# Altium project GSM.PrjPCB
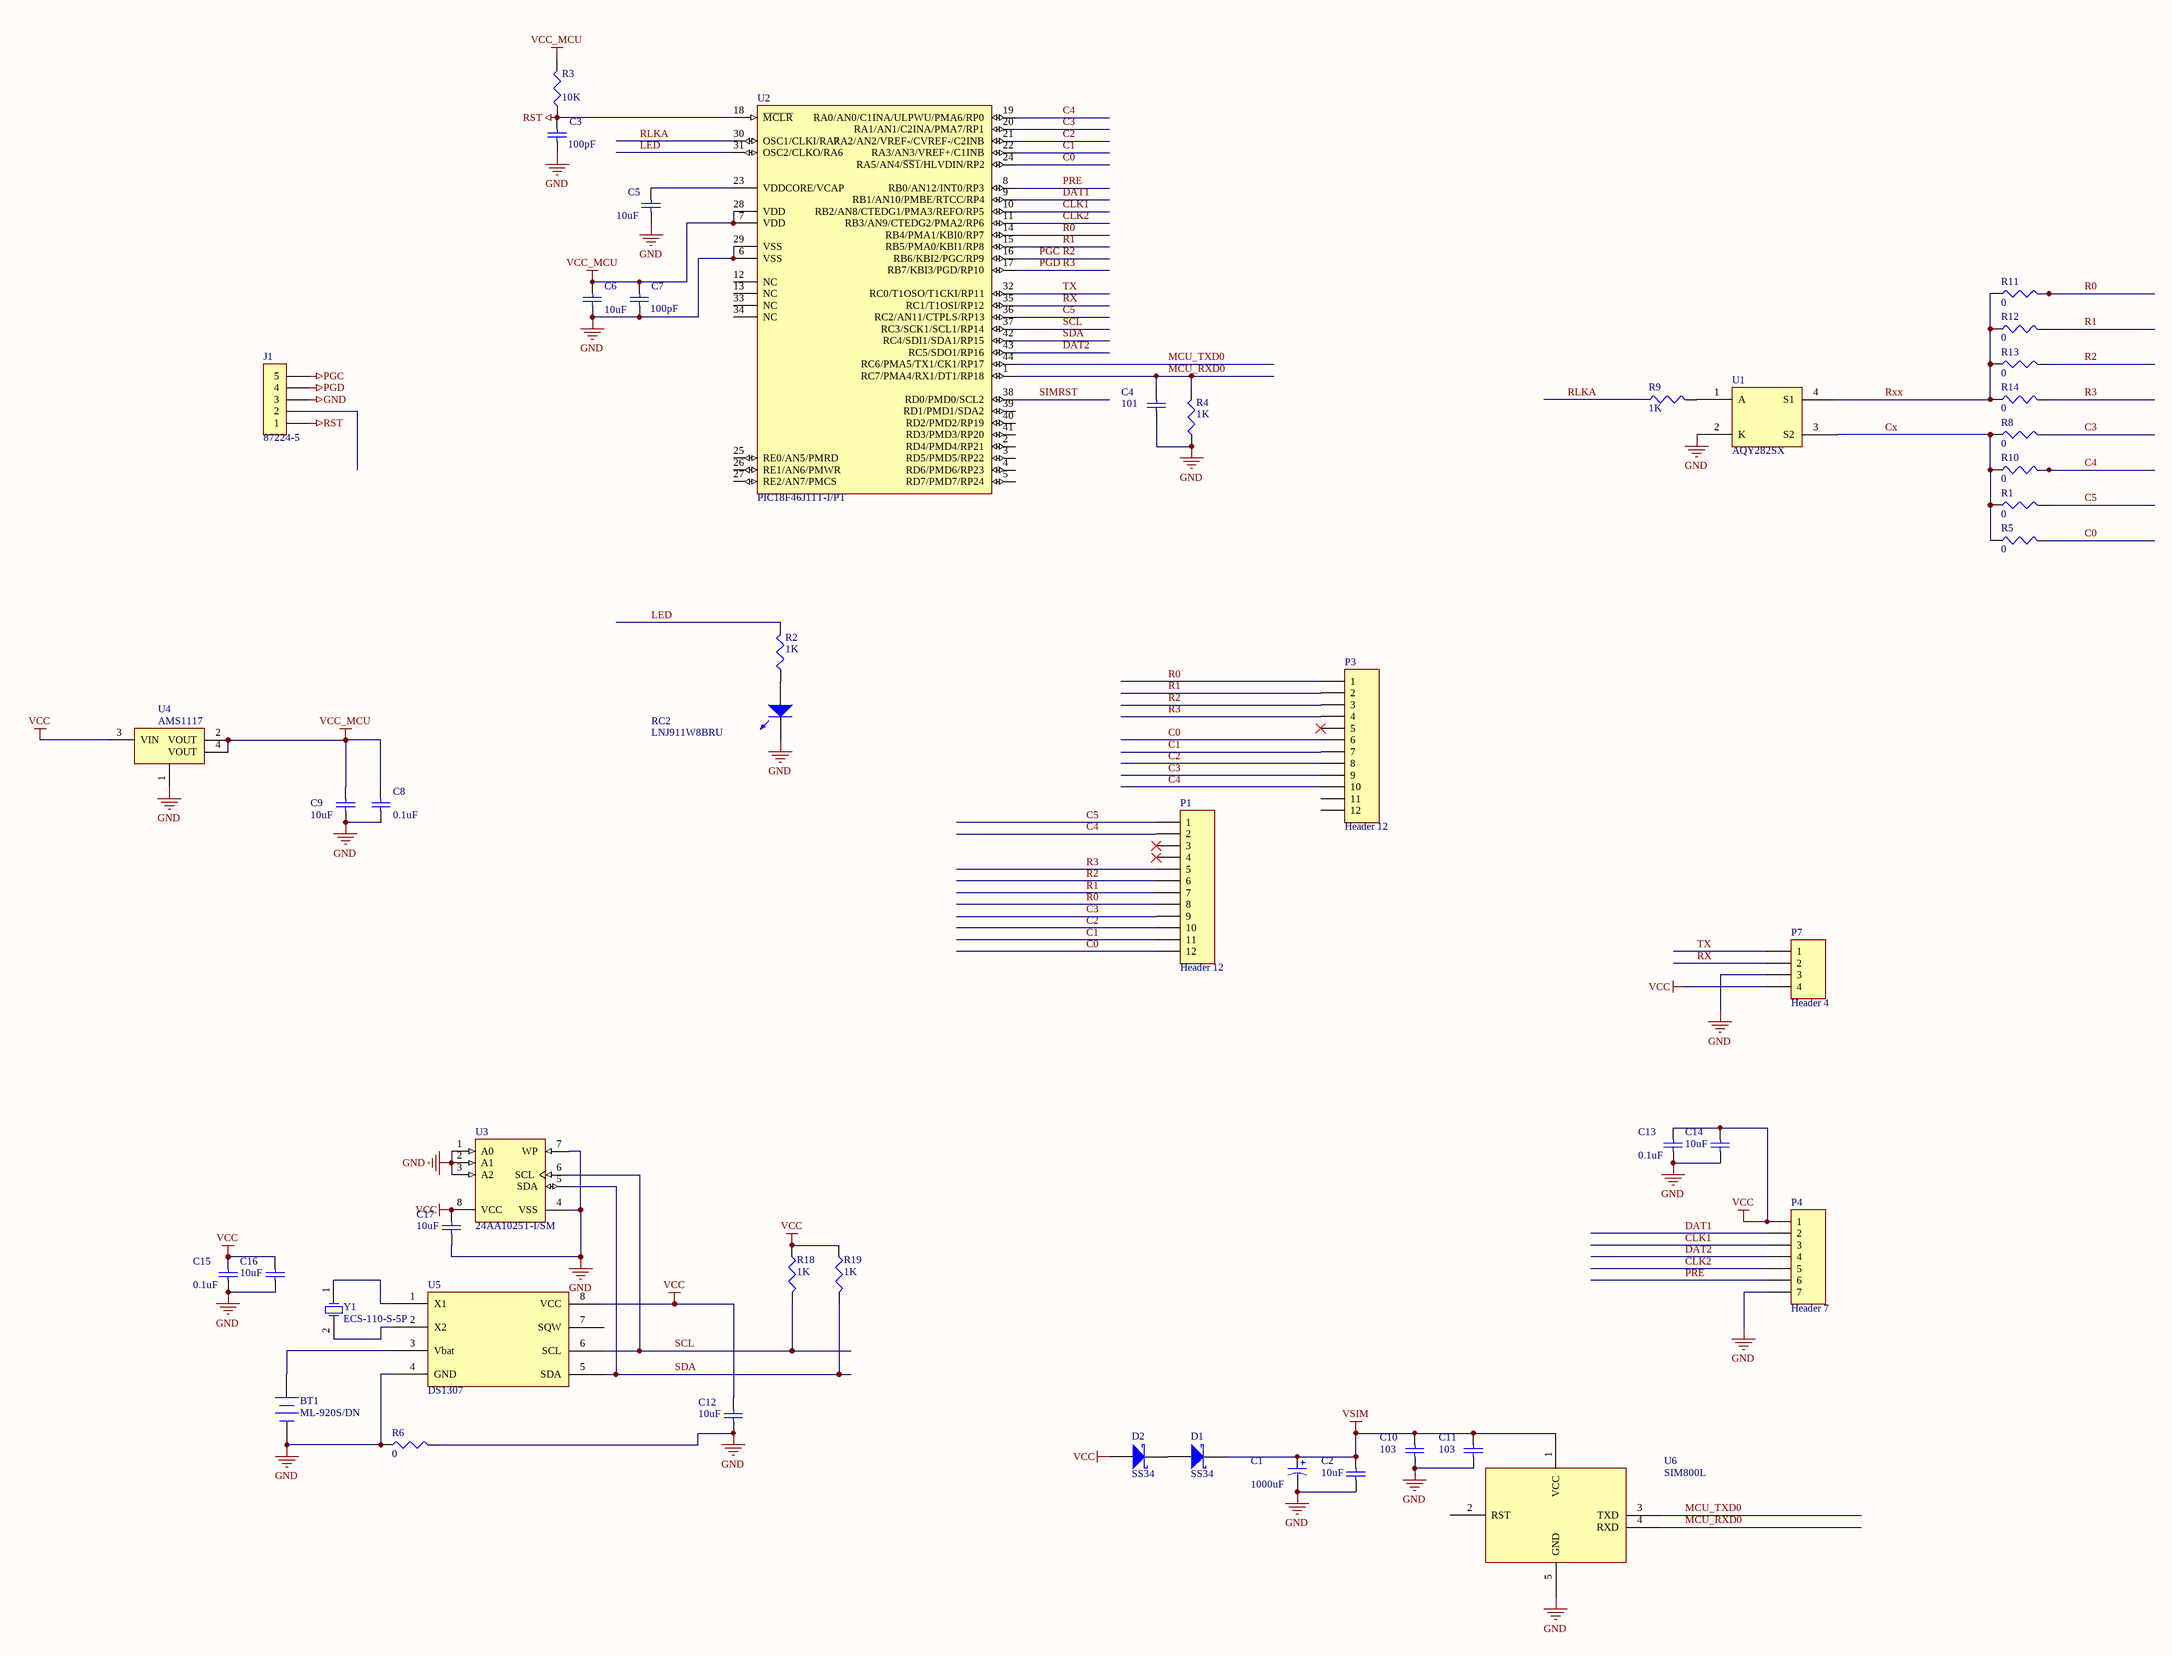
[diagram p0: Sheet1.SchDoc]
1 sheet, 48 parts. Net scope: global (net labels, ports and power ports of the same name join across sheets).
Board file: PCB1.PcbDoc

## Sheet Sheet1.SchDoc
size C

### Parts
BT1  ML-920S/DN  [ML-920S/DN]
C1  value 1000uF  [CAP8x8]  (hidden comment: EEE-FT1A102AP)
C2  value 10uF  [RESC2012L]  (hidden comment: LMK212F106ZG-T)
C3  value 100pF  [CAPC2013X05N]  (hidden comment: Cap Semi)
C4  value 101  [RESC2012L]  (hidden comment: LMK212F106ZG-T)
C5  value 10uF  [CAPC2013X05N]  (hidden comment: Cap Semi)
C6  value 10uF  [CAPC2013X05N]  (hidden comment: Cap Semi)
C7  value 100pF  [CAPC2013X05N]  (hidden comment: Cap Semi)
C8  value 0.1uF  [RESC2012L]  (hidden comment: CL21F104ZBCNNNC)
C9  value 10uF  [RESC2012L]  (hidden comment: LMK212F106ZG-T)
C10  value 103  [RESC2012L]  (hidden comment: LMK212F106ZG-T)
C11  value 103  [RESC2012L]  (hidden comment: LMK212F106ZG-T)
C12  value 10uF  [RESC2012L]  (hidden comment: LMK212F106ZG-T)
C13  value 0.1uF  [RESC2012L]  (hidden comment: CL21F104ZBCNNNC)
C14  value 10uF  [RESC2012L]  (hidden comment: LMK212F106ZG-T)
C15  value 0.1uF  [RESC2012L]  (hidden comment: CL21F104ZBCNNNC)
C16  value 10uF  [RESC2012L]  (hidden comment: LMK212F106ZG-T)
C17  value 10uF  [RESC2012L]  (hidden comment: LMK212F106ZG-T)
D1  SS34  [SMB]
D2  SS34  [SMB]
J1  87224-5  [CON5]
P1  Header 12  [HDR1X12]
P3  Header 12  [HDR1X12]
P4  Header 7  [HDR1X7]
P7  Header 4  [HDR1X4]
R1  value 0  [JUM1]  (hidden comment: ERJ-6GEYJ331V)
R2  value 1K  [RESC2012L]  (hidden comment: ERJ-6GEYJ102V)
R3  value 10K  [RESC2013X05N]  (hidden comment: Res3)
R4  value 1K  [RESC2012L]  (hidden comment: ERJ-6GEYJ102V)
R5  value 0  [JUM1]  (hidden comment: ERJ-6GEYJ331V)
R6  value 0  [JUM1]  (hidden comment: ERJ-6GEYJ331V)
R8  value 0  [JUM1]  (hidden comment: ERJ-6GEYJ331V)
R9  value 1K  [RESC2012L]  (hidden comment: ERJ-6GEYJ331V)
R10  value 0  [JUM1]  (hidden comment: ERJ-6GEYJ331V)
R11  value 0  [JUM1]  (hidden comment: ERJ-6GEYJ331V)
R12  value 0  [JUM1]  (hidden comment: ERJ-6GEYJ331V)
R13  value 0  [JUM1]  (hidden comment: ERJ-6GEYJ331V)
R14  value 0  [JUM1]  (hidden comment: ERJ-6GEYJ331V)
R18  value 1K  [RESC2012L]  (hidden comment: ERJ-6GEYJ331V)
R19  value 1K  [RESC2012L]  (hidden comment: ERJ-6GEYJ331V)
RC2  LNJ911W8BRU  [CD3216-1206]
U1  AQY282SX  [SOP4]
U2  PIC18F46J11T-I/PT  [TQFP-PT44_N]
U3  24AA1025T-I/SM  [SOIJ-SM8_N]
U4  AMS1117  [SOT223-4M]
U5  DS1307  [SOIJ-SM8_N]
U6  SIM800L  [SIM800L]
Y1  ECS-110-S-5P  [ABS07]

### Nets
GND: BT1.2(-) C1.2 C2.2 C3.1 C4.2 C5.1 C6.1 C7.1 C8.2 C9.2 C10.2 C11.2 C12.2 C13.2 C14.2 C15.2 C16.2 C17.2 J1.3 P4.7 P7.3 R4.2 R6.1 R6.2 RC2.2(K) U1.2(K) U2.6(VSS) U2.29(VSS) U3.1(A0) U3.2(A1) U3.3(A2) U3.4(VSS) U3.7(WP) U4.1(GND) U5.4(GND) U6.5(GND)
PGC: J1.5 P1.6 P3.3 R13.1 U2.16(RB6/KBI2/PGC/RP9)  [also labelled R2]
PGD: J1.4 P1.5 P3.4 R14.1 U2.17(RB7/KBI3/PGD/RP10)  [also labelled R3]
RST: C3.2 J1.1 R3.1 U2.18(~{MCLR})
VCC: C12.1 C13.1 C14.1 C15.1 C16.1 C17.1 D2.1(A) P4.1 P7.4 R18.2 R19.2 U3.8(VCC) U4.3(VIN) U5.8(VCC)
VCC_MCU: C6.2 C7.2 C8.1 C9.1 R3.2 U2.7(VDD) U2.28(VDD) U4.2(VOUT) U4.4(VOUT)
VSIM: C1.1 C2.1 C10.1 C11.1 D1.2(K) U6.1(VCC)
C0: P1.12 P3.6 R5.1 U2.24(RA5/AN4/~{SS1}/HLVDIN/RP2)
C1: P1.11 P3.7 U2.22(RA3/AN3/VREF+/C1INB)
C2: P1.10 P3.8 U2.21(RA2/AN2/VREF-/CVREF-/C2INB)
C3: P1.9 P3.9 R8.1 U2.20(RA1/AN1/C2INA/PMA7/RP1)
C4: P1.2 P3.10 R10.1 U2.19(RA0/AN0/C1INA/ULPWU/PMA6/RP0)
C5: P1.1 R1.1 U2.36(RC2/AN11/CTPLS/RP13)
CLK1: P4.3 U2.10(RB2/AN8/CTEDG1/PMA3/REFO/RP5)
CLK2: P4.5 U2.11(RB3/AN9/CTEDG2/PMA2/RP6)
Cx: R1.2 R5.2 R8.2 R10.2 U1.3(S2)
DAT1: P4.2 U2.9(RB1/AN10/PMBE/RTCC/RP4)
DAT2: P4.4 U2.43(RC5/SDO1/RP16)
LED: R2.1 U2.31(OSC2/CLKO/RA6)
MCU_RXD0: C4.1 R4.1 U2.1(RC7/PMA4/RX1/DT1/RP18) U6.4(RXD)
MCU_TXD0: U2.44(RC6/PMA5/TX1/CK1/RP17) U6.3(TXD)
PRE: P4.6 U2.8(RB0/AN12/INT0/RP3)
R0: P1.8 P3.1 R11.1 U2.14(RB4/PMA1/KBI0/RP7)
R1: P1.7 P3.2 R12.1 U2.15(RB5/PMA0/KBI1/RP8)
RLKA: R9.2 U2.30(OSC1/CLKI/RA7)
RX: P7.2 U2.35(RC1/T1OSI/RP12)
Rxx: R11.2 R12.2 R13.2 R14.2 U1.4(S1)
SCL: R18.1 U2.37(RC3/SCK1/SCL1/RP14) U3.6(SCL) U5.6(SCL)
SDA: R19.1 U2.42(RC4/SDI1/SDA1/RP15) U3.5(SDA) U5.5(SDA)
SIMRST: U2.38(RD0/PMD0/SCL2)
TX: P7.1 U2.32(RC0/T1OSO/T1CKI/RP11)
NetBT1_1: BT1.1(+) U5.3(Vbat)
NetC5_2: C5.2 U2.23(VDDCORE/VCAP)
NetD1_1: D1.1(A) D2.2(K)
NetR2_2: R2.2 RC2.1(A)
NetR9_1: R9.1 U1.1(A)
NetU5_1: U5.1(X1) Y1.1(OSC1)
NetU5_2: U5.2(X2) Y1.2(OSC2)

Not connected (* = marked no-connect by the designer): J1 2; P1 3* 4*; P3 5* 11 12; U2 2(RD4/PMD4/RP21) 3(RD5/PMD5/RP22) 4(RD6/PMD6/RP23) 5(RD7/PMD7/RP24) 12(NC) 13(NC) 25(RE0/AN5/PMRD) 26(RE1/AN6/PMWR) 27(RE2/AN7/PMCS) 33(NC) 34(NC) 39(RD1/PMD1/SDA2) 40(RD2/PMD2/RP19) 41(RD3/PMD3/RP20); U5 7(SQW); U6 2(RST)

### Library data of the parts
BT1 = Battery: Multicell Battery; Published: 24-Mar-1999; LatestRevisionDate: 17-Jul-2002; LatestRevisionNote: Re-released for DXP Platform.; PackageReference: BAT-2; Publisher: Altium Limited; PackageDescription: Battery; 2 Leads
C1 = Cap Pol1: CAP ALUM 1000UF 10V 20% SMD; Published: 8-Jun-2000; LatestRevisionDate: 17-Jul-2002; LatestRevisionNote: Re-released for DXP Platform.; PackageReference: RB7.6-15; Publisher: Altium Limited; PackageDescription: Polarized Capacitor (Radial); 2 Leads
C2 C4 C9-C12 C14 C16 C17 = Cap: CAP CER 10UF 10V Y5V 0805; Published: 8-Jun-2000; LatestRevisionDate: 17-Jul-2002; LatestRevisionNote: Re-released for DXP Platform.; PackageReference: RAD-0.3; Publisher: Altium Limited; PackageDescription: Radial Cap, Thru-Hole; 2 Leads; 0.3 in Pin Spacing
C3 C5-C7 = Cap Semi: Capacitor (Semiconductor SIM Model); Published: 8-Jun-2000; LatestRevisionDate: 29-May-2009; LatestRevisionNote: IPC-7351 Footprint Added.; PackageReference: C1206; Publisher: Altium Limited; PackageDescription: Chip Capacitor
C8 C13 C15 = Cap: CAP CER 0.1UF 50V Y5V 0805; Published: 8-Jun-2000; LatestRevisionDate: 17-Jul-2002; LatestRevisionNote: Re-released for DXP Platform.; PackageReference: RAD-0.3; Publisher: Altium Limited; PackageDescription: Radial Cap, Thru-Hole; 2 Leads; 0.3 in Pin Spacing
D1 D2 = D Schottky SS34: DIODE SCHOTTKY 40V 3A SMC; Published: 8-Jun-2000; LatestRevisionDate: 17-Jul-2002; LatestRevisionNote: Re-released for DXP Platform.; PackageReference: SMB; Publisher: Altium Limited; PackageDescription: DO-214-AA/SMB; 2 C-Bend Leads; Body 5.3 x 3.6 mm, inc. leads (LxW); Code_JEDEC: DO-214-AA
J1 = CON5: CONN HEADER VERT .100 5POS 15AU
P1 P3 = Header 12: Header, 12-Pin; LatestRevisionDate: 17-Jul-2002; LatestRevisionNote: Re-released for DXP Platform.; Publisher: Altium Limited
P4 = Header 7: Header, 7-Pin; LatestRevisionDate: 17-Jul-2002; LatestRevisionNote: Re-released for DXP Platform.; Publisher: Altium Limited
P7 = Header 4: Header, 4-Pin; LatestRevisionDate: 17-Jul-2002; LatestRevisionNote: Re-released for DXP Platform.; Publisher: Altium Limited
R1 R5 R6 R8-R14 R18 R19 = Res3: RES 330 OHM 1/8W 5% 0805 SMD; Published: 8-Jun-2000; LatestRevisionDate: 29-May-2009; LatestRevisionNote: IPC-7351 Footprint Added.; PackageReference: J1-0603; Publisher: Altium Limited; PackageDescription: Chip Resistor
R2 R4 = Res3: RES 1K OHM 1/8W 5% 0805 SMD; Published: 8-Jun-2000; LatestRevisionDate: 29-May-2009; LatestRevisionNote: IPC-7351 Footprint Added.; PackageReference: J1-0603; Publisher: Altium Limited; PackageDescription: Chip Resistor
R3 = Res3: Resistor; Published: 8-Jun-2000; LatestRevisionDate: 29-May-2009; LatestRevisionNote: IPC-7351 Footprint Added.; PackageReference: J1-0603; Publisher: Altium Limited; PackageDescription: Chip Resistor
RC2 = LEDRED1206: LED BLUE THRU BOARD 1206; VENDOR P/N: LH N974-KN-1; VENDOR: OSRAM Opto Semiconductors Inc; Indicate: 12V; GGC VENDOR: OSRAM Opto Semiconductors Inc; GCC P/N: LH N974-KN-1; DIGIKEY P/N: P0.0JCT-ND; DIGIKEY MOQ1: 0.11
U1 = AQY282SX: RELAY OPTO 60VAC/DC 500MA 4-SOP; Digi-Key Part Number: 255-3393-2-ND
U2 = PIC18F46J11T-I/PT: Low Power, High Performance Microcontroller with nanoWatt XLP Technology, 44-pin TQFP, Industrial Temperature, Tape and Reel; Published: 2-Dec-2009; DatasheetVersion: revC, Oct-2009; PackageVersion: revBB, Aug-2009; PackageReference: TQFP-PT44; Publisher: Altium Limited; PackageDescription: 44-Lead Plastic Thin Quad Flatpack (PT) - 10x10x1mm Body, 2.00mm [TQFP]; Supplier 1: Digi-Key; Supplier Part Number 1: PIC18F46J11T-I/PT-ND; Code_JEDEC: MS-026; ComponentLink1Description: Datasheet; ComponentLink1URL: http://ww1.microchip.com/downloads/en/DeviceDoc/39932c.pdf; ComponentLink2Description: Packaging Specification; ComponentLink2URL: http://www.microchip.com/stellent/groups/techpub_sg/documents/packagingspec/en012702.pdf; ComponentLink3Description: Microchip.com Home; ComponentLink3URL: http://www.microchip.com/
U3 = 24AA1025T-I/SM: 1 Mbit, 400kHz, 1.7V, I2C Serial EEPROM, 8-Pin SOIC 208mil, Industrial Temperature, Tape and Reel; Published: 29-Jan-2009; DatasheetVersion: revF, Oct-2008; PackageVersion: revBB, Aug-2009; PackageReference: SOIJ-SM8; Publisher: Altium Limited; PackageDescription: 8-Lead Plastic Small Outline (SM) - Medium, 5.28 mm Body [SOIJ]; Supplier 1: Digi-Key; Supplier Part Number 1: 24AA1025T-I/SM-ND; ComponentLink1Description: Datasheet; ComponentLink1URL: http://ww1.microchip.com/downloads/en/DeviceDoc/21941F.pdf; ComponentLink2Description: Packaging Specification; ComponentLink2URL: http://www.microchip.com/stellent/groups/techpub_sg/documents/packagingspec/en012702.pdf; ComponentLink3Description: Microchip.com Home; ComponentLink3URL: http://www.microchip.com/
U4 = AMS1117: Adjustable Precision Shunt Regulator; Published: 15-Apr-2002; DatasheetVersion: Oct-2000; PackageVersion: Oct-1994; PackageReference: PK03; Publisher: Altium Limited; PackageDescription: SOT-89; Body 4.6 x 4.25 mm, inc. leads (LxW max); Code_JEDEC: TO-243-AA; Code_IPC: SOT 89; ComponentLink1Description: Manufacturer Link; ComponentLink1URL: http://www.ti.com/; ComponentLink2Description: Datasheet; ComponentLink2URL: http://www-s.ti.com/sc/ds/tl431a.pdf
Y1 = ECS-110-S-5P: Crystal Oscillator; Published: 17-Jul-2002; DatasheetDocument: 18-Apr-2000; PackageReference: CSM-7; Publisher: Altium Limited; ComponentLink1Description: Manufacturer Link; ComponentLink1URL: http://www.ecsxtal.com/; ComponentLink2Description: Datasheet; ComponentLink2URL: http://www.ecsxtal.com/pdf3/CSM_7.pdf